# EAGLE schematic CoolShield (EAGLE 6.1)
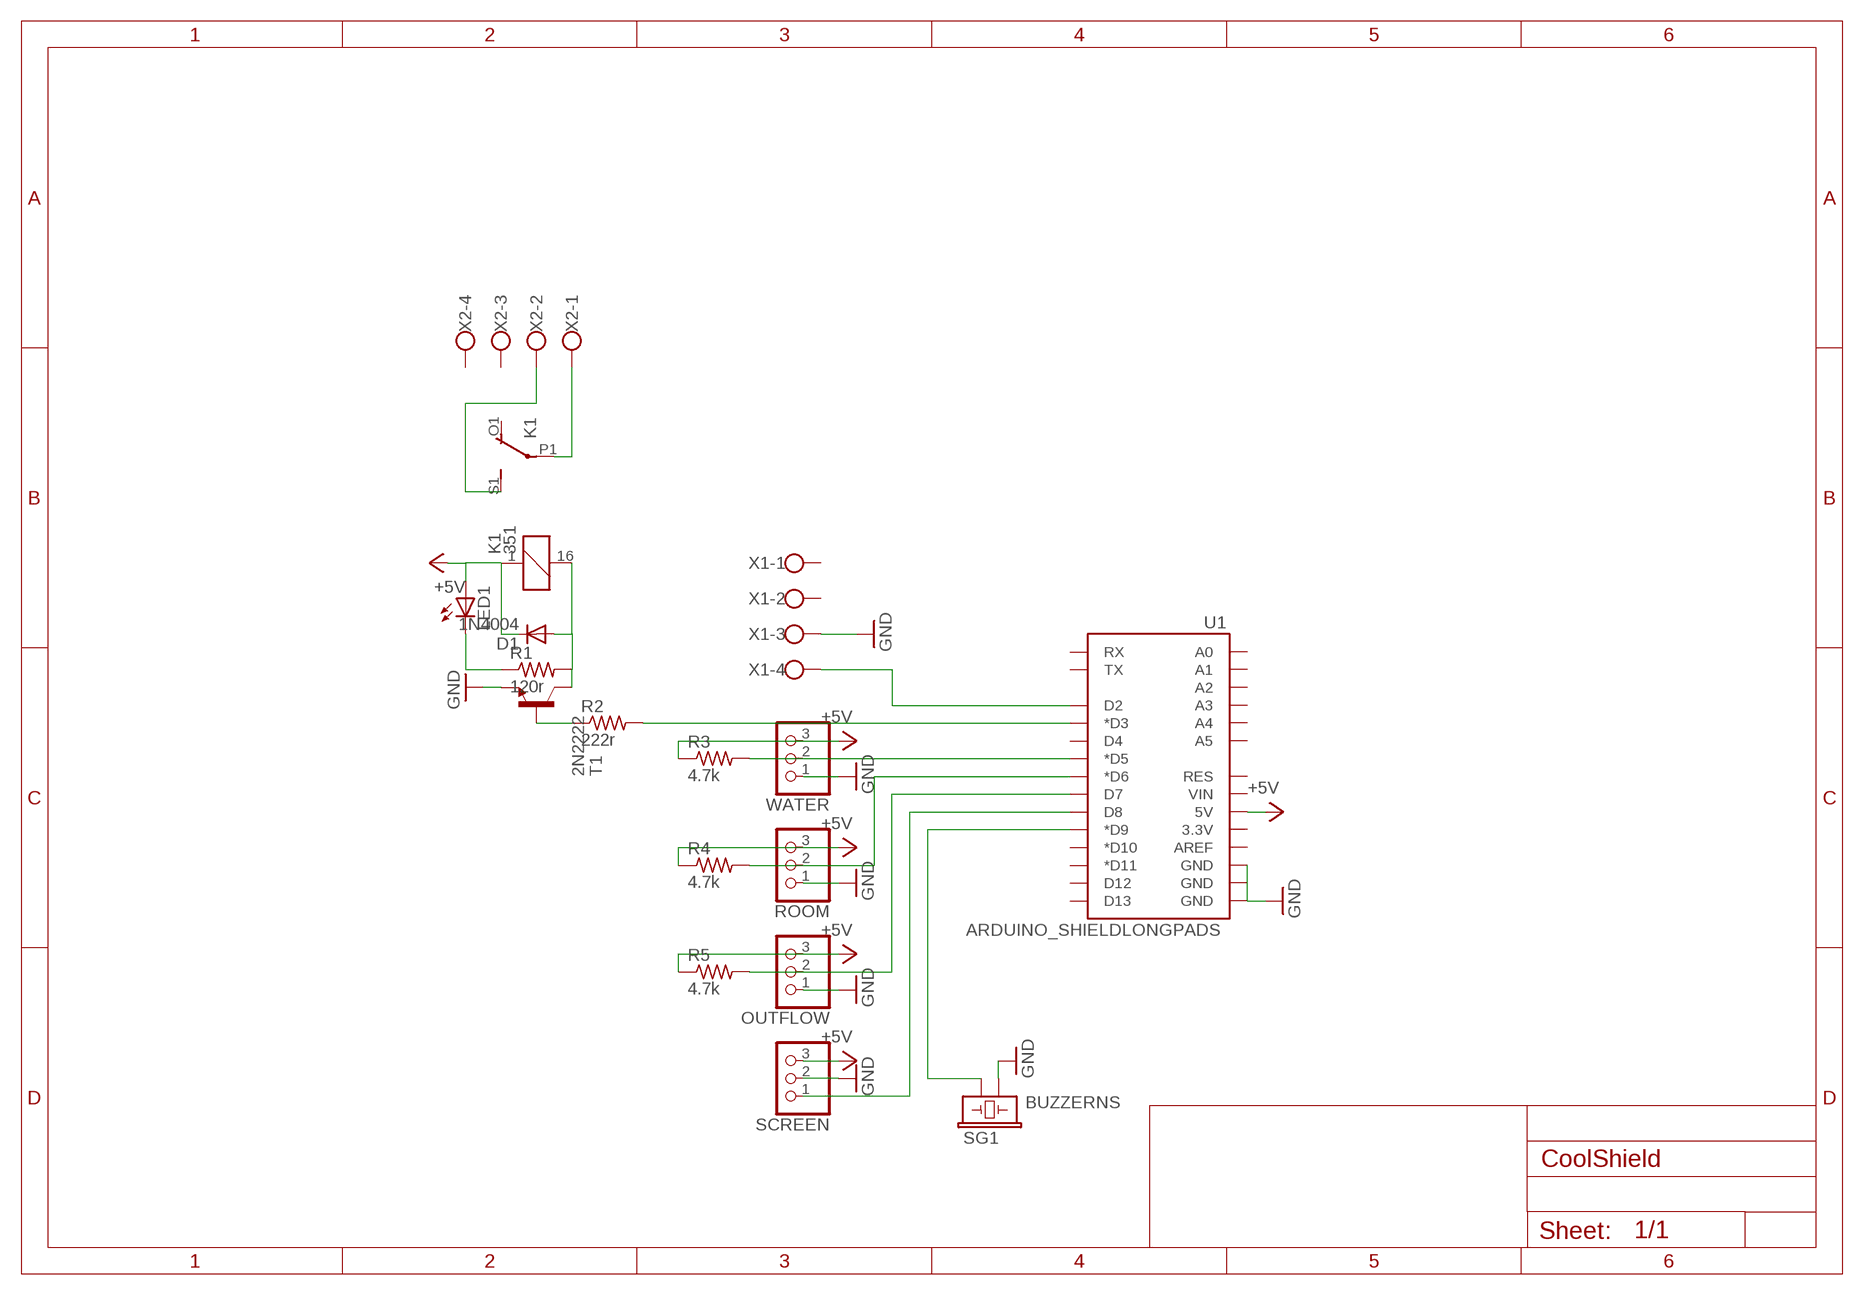
[diagram p0: schematic, sheet 1]

## Parts
D1  1N4004  [DO41-10]
K1  351  [351]
LED1  LED5MM  [LED5MM]
OUTFLOW  PINHD-1X3  [1X03]
R1  120r  R-US_0204/7  [0204/7]
R2  222r  R-US_0204/7  [0204/7]
R3  4.7k  R-US_0204/7  [0204/7]
R4  4.7k  R-US_0204/7  [0204/7]
R5  4.7k  R-US_0204/7  [0204/7]
ROOM  PINHD-1X3  [1X03]
SCREEN  PINHD-1X3  [1X03]
SG1  BUZZERNS  [BUZZER-12MM-NS]
T1  2N2222  [TO92-EBC-OVAL]
U1  ARDUINO_SHIELDLONGPADS  [DUEMILANOVE_SHIELD_LONGPADS]
WATER  PINHD-1X3  [1X03]
X1  W237-4  [W237-4]
X2  W237-4  [W237-4]

## Nets
+5V: D1.C K1.1 LED1.A OUTFLOW.3 R3.1 R4.1 R5.1 ROOM.3 SCREEN.3 U1.5V WATER.3
GND: OUTFLOW.1 ROOM.1 SCREEN.2 SG1.- T1.E U1.GND@0(GND) U1.GND@1(GND) U1.GND@2(GND) WATER.1 X1.3
N$1: U1.D2 X1.4
N$2: R3.2 U1.D5(*D5) WATER.2
N$3: R4.2 ROOM.2 U1.D6(*D6)
N$4: SCREEN.1 U1.D8
N$5: OUTFLOW.2 R5.2 U1.D7
N$6: D1.A K1.16 R1.2 T1.C
N$7: LED1.K(C) R1.1
N$8: R2.1 T1.B
N$9: R2.2 U1.D3(*D3)
N$10: K1.P1(2:P) X2.1
N$11: K1.S1(2:S) X2.2
N$12: SG1.+ U1.D9(*D9)
Unconnected: K1.O1(2:O) K1.O2(3:O) K1.P2(3:P) K1.S2(3:S) U1.3.3V U1.A0 U1.A1 U1.A2 U1.A3 U1.A4 U1.A5 U1.AREF U1.D4 U1.D10(*D10) U1.D11(*D11) U1.D12 U1.D13 U1.RES U1.RX U1.TX U1.VIN X1.1 X1.2 X2.3 X2.4

## Library data of the parts
D1 = adafruit:1N4004: DIODE General purpose 1N400x type rectifier (With bigger pads) http://www.ladyada.net/library/pcb/eaglelibrary.html
K1 = relay:351: RELAY 2 x switch, Omron
LED1 = adafruit:LED: LED OSRAM: - CHIPLED LG R971, LG N971, LY N971, LG Q971, LY Q971, LO R971, LY R971 LH N974, LH R974 LS Q976, LO Q976, LY Q976 LO Q996 - Hyper CHIPLED LW Q18S LB Q993, LB Q99A, LB R99A - SideLED LS A670, LO A670, LY A670, LG A670, LP A670 LB A673, LV A673, LT A673, LW A673 LH A674 LY A675 LS A676, LA A676, LO A676, LY A676, LW A676 LS A679, LY A679, LG A679 - Hyper Micro SIDELED® LS Y876, LA Y876, LO Y876, LY Y876 LT Y87S - SmartLED LW L88C, LW L88S LB L89C, LB L89S, LG L890 LS L89K, LO L89K, LY L89K LS L896, LA L896, LO L896, LY L896 - TOPLED LS T670, LO T670, LY T670, LG T670, LP T670 LSG T670, LSP T670, LSY T670, LOP T670, LYG T670 LG T671, LOG T671, LSG T671 LB T673, LV T673, LT T673, LW T673 LH T674 LS T676, LA T676, LO T676, LY T676, LB T676, LH T676, LSB T676, LW T676 LB T67C, LV T67C, LT T67C, LS T67K, LO T67K, LY T67K, LW E67C LS E67B, LA E67B, LO E67B, LY E67B, LB E67C, LV E67C, LT E67C LW T67C LS T679, LY T679, LG T679 LS T770, LO T770, LY T770, LG T770, LP T770 LB T773, LV T773, LT T773, LW T773 LH T774 LS E675, LA E675, LY E675, LS T675 LS T776, LA T776, LO T776, LY T776, LB T776 LHGB T686 LT T68C, LB T68C - Hyper Mini TOPLED® LB M676 - Mini TOPLED Santana® LG M470 LS M47K, LO M47K, LY M47K Source: http://www.osram.convergy.de/
OUTFLOW ROOM SCREEN WATER = pinhead:PINHD-1X3: PIN HEADER
R1-R5 = adafruit:R-US_: RESISTOR, American symbol
SG1 = SparkFun:BUZZER: Buzzer 12mm Spark Fun Electronics SKU : Comp-Buzzer
T1 = adafruit:2N2222: NPN TRANSISTOR Big oval pads
U1 = SparkFun-Boards:ARDUINO_SHIELD: Arduino shield footprint
X1 X2 = con-wago-500:W237-4: WAGO SCREW CLAMP